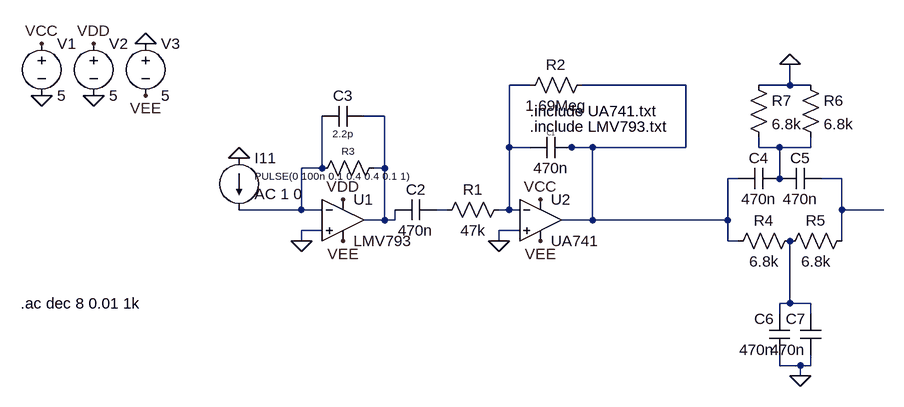
[diagram p0: schematic Draft2.asc]
Draft2.asc, the LTspice schematic file:
Version 4
SHEET 1 884 680
WIRE 336 -32 304 -32
WIRE 576 -32 416 -32
WIRE 736 -32 736 -64
WIRE 736 -32 688 -32
WIRE 768 -32 736 -32
WIRE 112 16 80 16
WIRE 304 64 304 -32
WIRE 336 64 304 64
WIRE 400 64 384 64
WIRE 432 64 400 64
WIRE 576 64 576 -32
WIRE 576 64 432 64
WIRE 688 64 688 48
WIRE 720 64 688 64
WIRE 768 64 768 48
WIRE 768 64 720 64
WIRE 16 96 16 16
WIRE 16 96 -16 96
WIRE 112 96 112 16
WIRE 112 96 96 96
WIRE 656 112 640 112
WIRE 720 112 720 64
WIRE 816 112 784 112
WIRE -16 160 -16 96
WIRE -16 160 -112 160
WIRE 16 160 -16 160
WIRE 208 160 192 160
WIRE 304 160 304 64
WIRE 304 160 288 160
WIRE 320 160 304 160
WIRE 816 160 816 112
WIRE 880 160 816 160
WIRE 112 176 112 96
WIRE 112 176 80 176
WIRE 128 176 128 160
WIRE 128 176 112 176
WIRE 432 176 432 64
WIRE 432 176 384 176
WIRE 640 176 640 112
WIRE 640 176 432 176
WIRE 16 192 -16 192
WIRE 320 192 288 192
WIRE -16 208 -16 192
WIRE 288 208 288 192
WIRE 640 208 640 176
WIRE 656 208 640 208
WIRE 816 208 816 160
WIRE 736 304 736 208
WIRE 736 304 720 304
WIRE 768 304 736 304
WIRE 720 320 720 304
WIRE 768 320 768 304
WIRE 720 400 720 384
WIRE 752 400 720 400
WIRE 768 400 768 384
WIRE 768 400 752 400
WIRE 752 416 752 400
FLAG -16 208 0
FLAG 288 208 0
FLAG 48 208 VEE
FLAG 352 208 VEE
FLAG 48 144 VDD
FLAG 352 144 VCC
FLAG -416 -96 VCC
FLAG -336 -96 VDD
FLAG -256 -16 VEE
FLAG -416 -16 0
FLAG -336 -16 0
FLAG -256 -96 0
FLAG -112 80 0
FLAG 752 416 0
FLAG 736 -64 0
SYMBOL Opamps\\opamp2 48 112 R0
SYMATTR InstName U1
SYMATTR Value LMV793
SYMBOL Opamps\\opamp2 352 112 R0
SYMATTR InstName U2
SYMATTR Value UA741
SYMBOL res 112 80 R90
WINDOW 0 0 56 VBottom 1
WINDOW 3 41 30 Invisible 1
SYMATTR InstName R3
SYMATTR Value 10k
SYMBOL cap 80 0 R90
WINDOW 0 0 32 VBottom 2
WINDOW 3 32 32 VTop 1
SYMATTR InstName C3
SYMATTR Value 2.2p
SYMBOL voltage -416 -112 R0
WINDOW 123 0 0 Left 0
WINDOW 39 0 0 Left 0
SYMATTR InstName V1
SYMATTR Value 5
SYMBOL voltage -336 -112 R0
WINDOW 123 0 0 Left 0
WINDOW 39 0 0 Left 0
SYMATTR InstName V2
SYMATTR Value 5
SYMBOL voltage -256 -112 R0
WINDOW 123 0 0 Left 0
WINDOW 39 0 0 Left 0
SYMATTR InstName V3
SYMATTR Value 5
SYMBOL current -112 80 R0
WINDOW 123 24 56 Left 2
WINDOW 39 0 0 Left 0
WINDOW 3 24 28 Left 1
SYMATTR Value2 AC 1 0
SYMATTR Value PULSE(0 100n 0.1 0.4 0.4 0.1 1)
SYMATTR InstName I11
SYMBOL cap 720 96 R90
WINDOW 0 0 32 VBottom 2
WINDOW 3 32 32 VTop 2
SYMATTR InstName C4
SYMATTR Value 470n
SYMBOL cap 784 96 R90
WINDOW 0 0 32 VBottom 2
WINDOW 3 32 32 VTop 2
SYMATTR InstName C5
SYMATTR Value 470n
SYMBOL cap 736 384 R180
WINDOW 0 24 56 Left 2
WINDOW 3 24 8 Left 2
SYMATTR InstName C6
SYMATTR Value 470n
SYMBOL cap 784 384 R180
WINDOW 0 24 56 Left 2
WINDOW 3 24 8 Left 2
SYMATTR InstName C7
SYMATTR Value 470n
SYMBOL res 752 192 R90
WINDOW 0 0 56 VBottom 2
WINDOW 3 32 56 VTop 2
SYMATTR InstName R4
SYMATTR Value 6.8k
SYMBOL res 832 192 R90
WINDOW 0 0 56 VBottom 2
WINDOW 3 32 56 VTop 2
SYMATTR InstName R5
SYMATTR Value 6.8k
SYMBOL res 752 -48 R0
SYMATTR InstName R6
SYMATTR Value 6.8k
SYMBOL res 672 -48 R0
SYMATTR InstName R7
SYMATTR Value 6.8k
SYMBOL res 304 144 R90
WINDOW 0 0 56 VBottom 2
WINDOW 3 32 56 VTop 2
SYMATTR InstName R1
SYMATTR Value 47k
SYMBOL cap 400 48 R90
WINDOW 0 0 32 VBottom 0
WINDOW 3 32 32 VTop 2
SYMATTR InstName C1
SYMATTR Value 470n
SYMBOL res 432 -48 R90
WINDOW 0 0 56 VBottom 2
WINDOW 3 32 56 VTop 2
SYMATTR InstName R2
SYMATTR Value 1.69Meg
SYMBOL cap 192 144 R90
WINDOW 0 0 32 VBottom 2
WINDOW 3 32 32 VTop 2
SYMATTR InstName C2
SYMATTR Value 470n
TEXT 336 8 Left 2 !.include UA741.txt
TEXT 336 32 Left 2 !.include LMV793.txt
TEXT -448 304 Left 2 !.ac dec 8 0.01 1k

The netlist it stands for:
* Draft2.asc
XU1 0 N005 VDD VEE N003 LMV793  ; pins In+ In- V+ V- OUT
XU2 0 N001 VCC VEE N002 UA741  ; pins In+ In- V+ V- OUT
R3 N003 N005 10k
C3 N003 N005 2.2p
V1 VCC 0 5
V2 VDD 0 5
V3 0 VEE 5
I11 0 N005 PULSE(0 100n 0.1 0.4 0.4 0.1 1) AC 1 0
C4 N004 N002 470n
C5 N006 N004 470n
C6 0 N008 470n
C7 0 N008 470n
R4 N008 N002 6.8k
R5 N006 N008 6.8k
R6 0 N004 6.8k
R7 0 N004 6.8k
R1 N001 N007 47k
C1 N002 N001 470n
R2 N002 N001 1.69Meg
C2 N007 N003 470n
.include UA741.txt
.include LMV793.txt
.ac dec 8 0.01 1k
.backanno
.end